# EAGLE design baxandall (EAGLE 7.7.0)

## Sheet 1 of 6
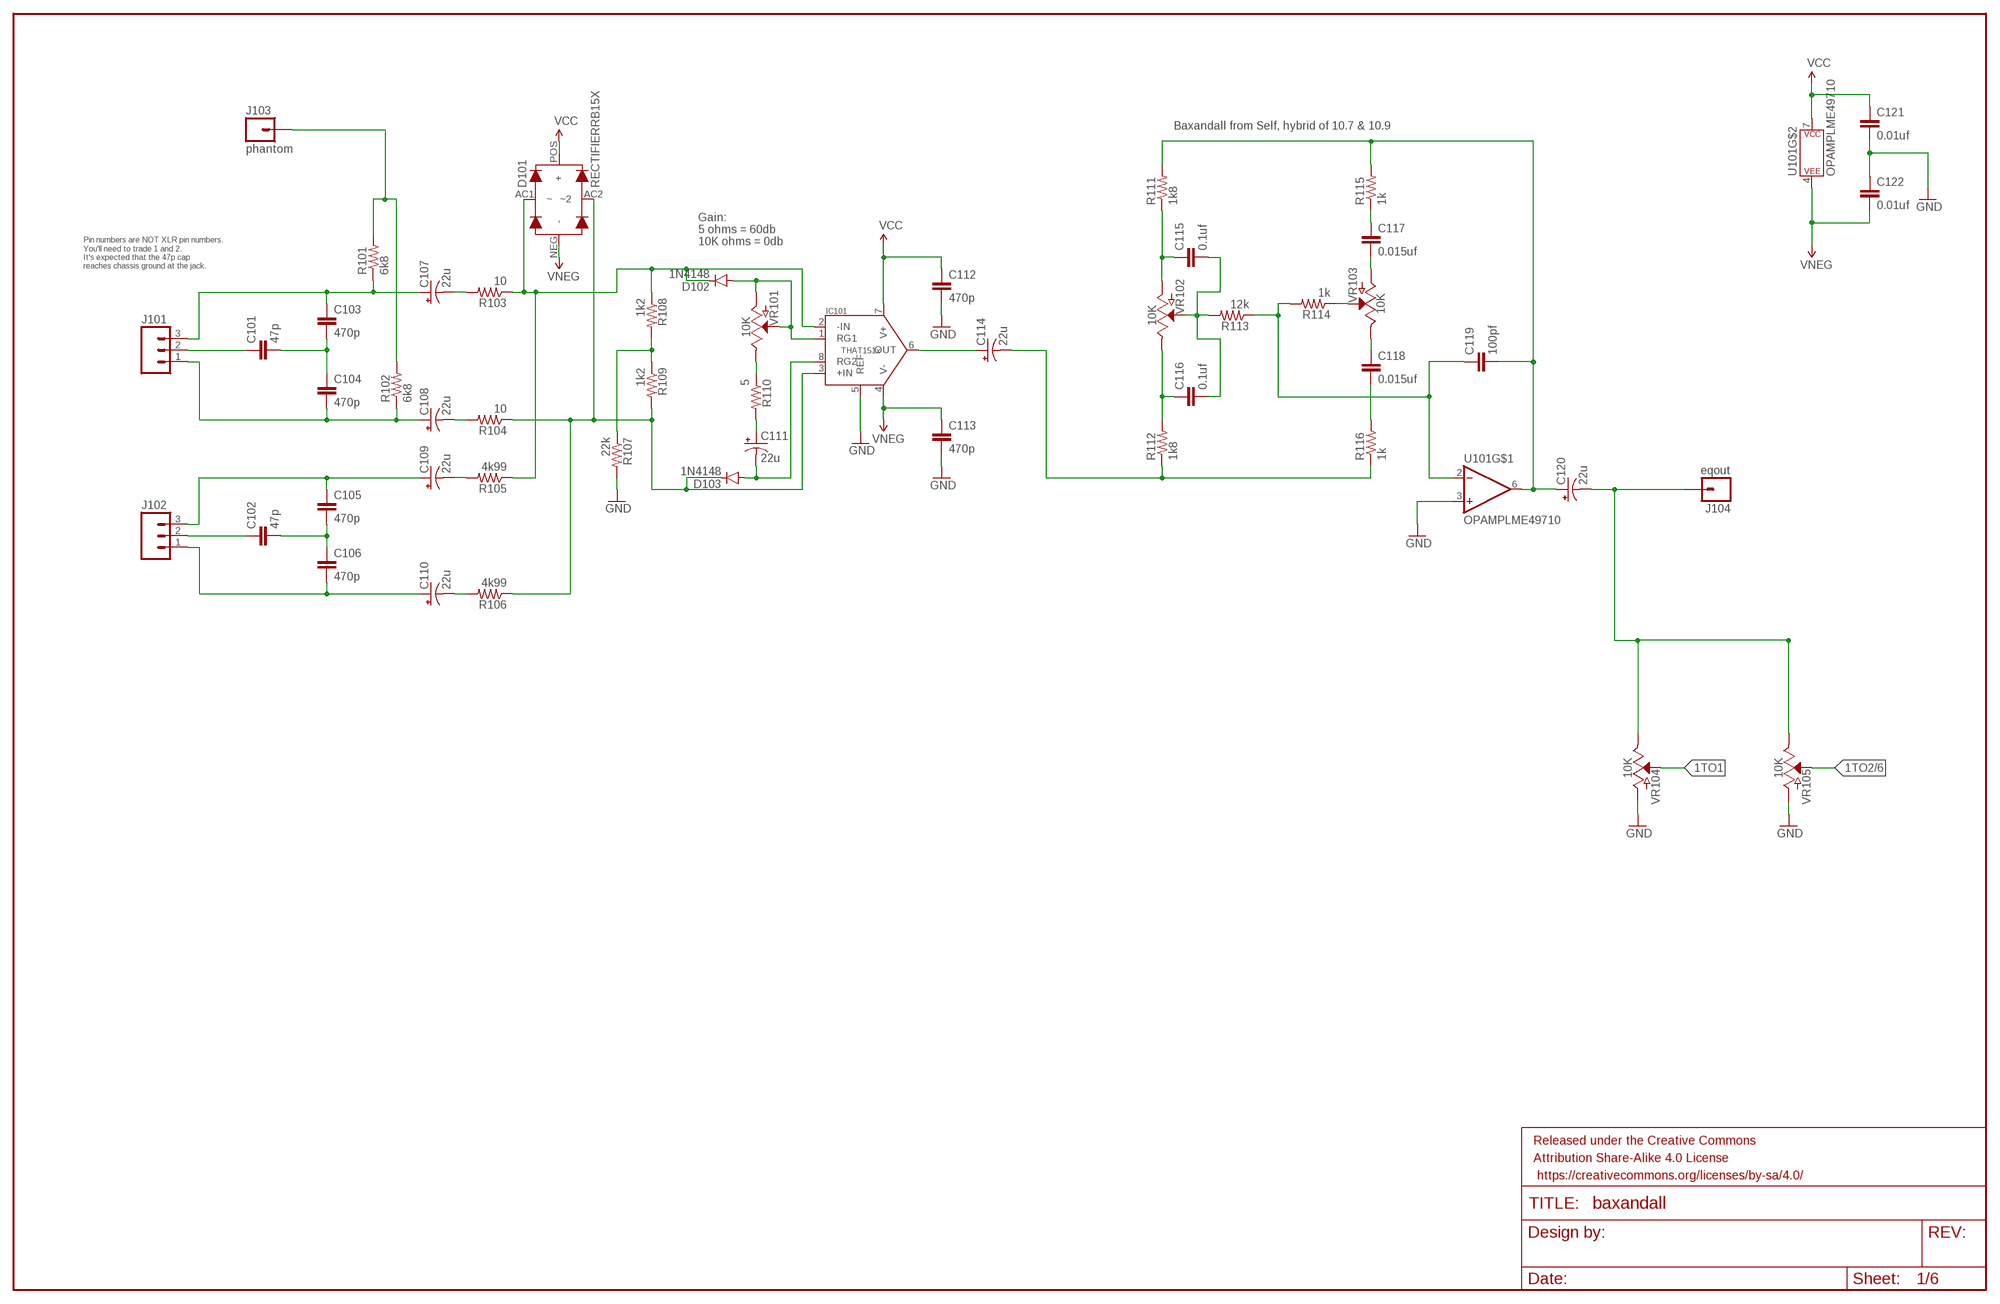
[diagram p0: schematic, sheet 1]

### Parts
C101  47p  CAPPTH  [CAP-PTH-SMALL]
C102  47p  CAPPTH  [CAP-PTH-SMALL]
C103  470p  CAPPTH  [CAP-PTH-SMALL]
C104  470p  CAPPTH  [CAP-PTH-SMALL]
C105  470p  CAPPTH  [CAP-PTH-SMALL]
C106  470p  CAPPTH  [CAP-PTH-SMALL]
C107  22u  100UF-25V-20%(PTH)  [CPOL-RADIAL-100UF-25V]
C108  22u  100UF-25V-20%(PTH)  [CPOL-RADIAL-100UF-25V]
C109  22u  100UF-25V-20%(PTH)  [CPOL-RADIAL-100UF-25V]
C110  22u  100UF-25V-20%(PTH)  [CPOL-RADIAL-100UF-25V]
C111  22u  100UF-25V-20%(PTH)  [CPOL-RADIAL-100UF-25V]
C112  470p  CAPPTH  [CAP-PTH-SMALL]
C113  470p  CAPPTH  [CAP-PTH-SMALL]
C114  22u  100UF-25V-20%(PTH)  [CPOL-RADIAL-100UF-25V]
C115  0.1uf  WIMA-MKS20.1UF  [WIMA-MKS2-2.5X7.2]
C116  0.1uf  WIMA-MKS20.1UF  [WIMA-MKS2-2.5X7.2]
C117  0.015uf  WIMA-MKS20.015UF  [WIMA-MKS2-2.5X7.2]
C118  0.015uf  WIMA-MKS20.015UF  [WIMA-MKS2-2.5X7.2]
C119  100pf  CAPPTH  [CAP-PTH-SMALL]
C120  22u  100UF-25V-20%(PTH)  [CPOL-RADIAL-100UF-25V]
C121  0.01uf  WIMA-MKS20.01UF  [WIMA-MKS2-2.5X7.2]
C122  0.01uf  WIMA-MKS20.01UF  [WIMA-MKS2-2.5X7.2]
D101  RECTIFIERRB15X  [SM-RECTIFIER]
D102  1N4148  DIODE1N4148  [DIODE-1N4148]
D103  1N4148  DIODE1N4148  [DIODE-1N4148]
FRAME101  FRAME-LEDGER  [CREATIVE_COMMONS]
IC101  THAT151x  THAT151X  [DIP08-KIT]
J101  M031X03_NO_SILK  [1X03_NO_SILK]
J102  M031X03_NO_SILK  [1X03_NO_SILK]
J103  phantom  M01NOSILK-KIT  [1X01NS-KIT]
J104  eqout  M01NOSILK-KIT  [1X01NS-KIT]
R101  6k8  10KOHM-1/4W-1%(PTH)HORIZ  [AXIAL-0.3]
R102  6k8  10KOHM-1/4W-1%(PTH)HORIZ  [AXIAL-0.3]
R103  10  10KOHM-1/4W-1%(PTH)HORIZ  [AXIAL-0.3]
R104  10  10KOHM-1/4W-1%(PTH)HORIZ  [AXIAL-0.3]
R105  4k99  10KOHM-1/4W-1%(PTH)HORIZ  [AXIAL-0.3]
R106  4k99  10KOHM-1/4W-1%(PTH)HORIZ  [AXIAL-0.3]
R107  22k  10KOHM-1/4W-1%(PTH)HORIZ  [AXIAL-0.3]
R108  1k2  10KOHM-1/4W-1%(PTH)HORIZ  [AXIAL-0.3]
R109  1k2  10KOHM-1/4W-1%(PTH)HORIZ  [AXIAL-0.3]
R110  5  10KOHM-1/4W-1%(PTH)HORIZ  [AXIAL-0.3]
R111  1k8  10KOHM-1/4W-1%(PTH)HORIZ  [AXIAL-0.3]
R112  1k8  10KOHM-1/4W-1%(PTH)HORIZ  [AXIAL-0.3]
R113  12k  10KOHM-1/4W-1%(PTH)HORIZ  [AXIAL-0.3]
R114  1k  10KOHM-1/4W-1%(PTH)HORIZ  [AXIAL-0.3]
R115  1k  10KOHM-1/4W-1%(PTH)HORIZ  [AXIAL-0.3]
R116  1k  10KOHM-1/4W-1%(PTH)HORIZ  [AXIAL-0.3]
U101  OPAMPLME49710  [DIP08-KIT]
VR101  10K  POTROT-SW-POT  [ROT-SW-POT]
VR102  10K  POT10K-VERTPIN  [ALPHA-RV24AF40-POT]
VR103  10K  POT10K-VERTPIN  [ALPHA-RV24AF40-POT]
VR104  10K  POT10K-VERTPIN  [ALPHA-RV24AF40-POT]
VR105  10K  POT10K-VERTPIN  [ALPHA-RV24AF40-POT]

### Nets
1TO1: VR104.WIP(S)
1TO2: VR105.WIP(S) ; also sheet 6
GND: C112.2 C113.2 C121.P$2 C122.P$1 IC101.5(REF) R107.P$2 U101.3(+IN) VR104.CCW(A) VR105.CCW(A) ; also sheet 6
N$1: C115.P$1 R111.P$1 VR102.CCW(A)
N$2: C116.P$1 R112.P$2 VR102.CW(E)
N$3: C119.1 R113.P$1 R114.P$2 U101.2(-IN)
N$4: C118.P$2 R116.P$2
N$5: C120.2(-) J104.1 VR104.CW(E) VR105.CW(E)
N$6: C119.2 C120.1(+) R111.P$2 R115.P$2 U101.6(OUT)
N$8: R114.P$1 VR103.WIP(S)
N$9: C114.2(-) R112.P$1 R116.P$1
N$10: C118.P$1 VR103.CW(E)
N$14: C115.P$2 C116.P$2 R113.P$2 VR102.WIP(S)
N$15: C117.P$2 VR103.CCW(A)
N$19: C117.P$1 R115.P$1
N$21: C111.2(-) D103.A IC101.8(RG2)
N$22: C114.1(+) IC101.6(OUT)
N$23: C101.1 J101.2
N$24: C101.2 C103.2 C104.1
N$25: C103.1 C107.1(+) J101.3 R101.P$1
N$26: C104.2 C108.1(+) J101.1 R102.P$1
N$27: C108.2(-) R104.P$2
N$28: J103.1 R101.P$2 R102.P$2
N$29: C107.2(-) R103.P$2
N$30: D101.AC1(~) D102.C IC101.2(-IN) R103.P$1 R105.P$1 R108.P$1
N$31: D101.AC2(~2) D103.C IC101.3(+IN) R104.P$1 R106.P$1 R109.P$2
N$32: R107.P$1 R108.P$2 R109.P$1
N$33: D102.A IC101.1(RG1) VR101.CCW(A) VR101.WIP(S)
N$34: R110.P$1 VR101.CW(E)
N$35: C111.1(+) R110.P$2
N$36: C102.1 J102.2
N$37: C102.2 C105.2 C106.1
N$38: C105.1 C109.1(+) J102.3
N$39: C106.2 C110.1(+) J102.1
N$40: C110.2(-) R106.P$2
N$42: C109.2(-) R105.P$2
VCC: C112.1 C121.P$1 D101.POS(+) IC101.7(V+) U101.7(P$V+) ; also sheet 6
VNEG: C113.1 C122.P$2 D101.NEG(-) IC101.4(V-) U101.4(P$V-) ; also sheet 6

### Notes on the sheet
- Baxandall from Self, hybrid of 10.7 & 10.9
- Gain: 
  5 ohms = 60db
  10K ohms = 0db
- Pin numbers are NOT XLR pin numbers.
  You'll need to trade 1 and 2.
  It's expected that the 47p cap
  reaches chassis ground at the jack.

## Sheet 2 of 6
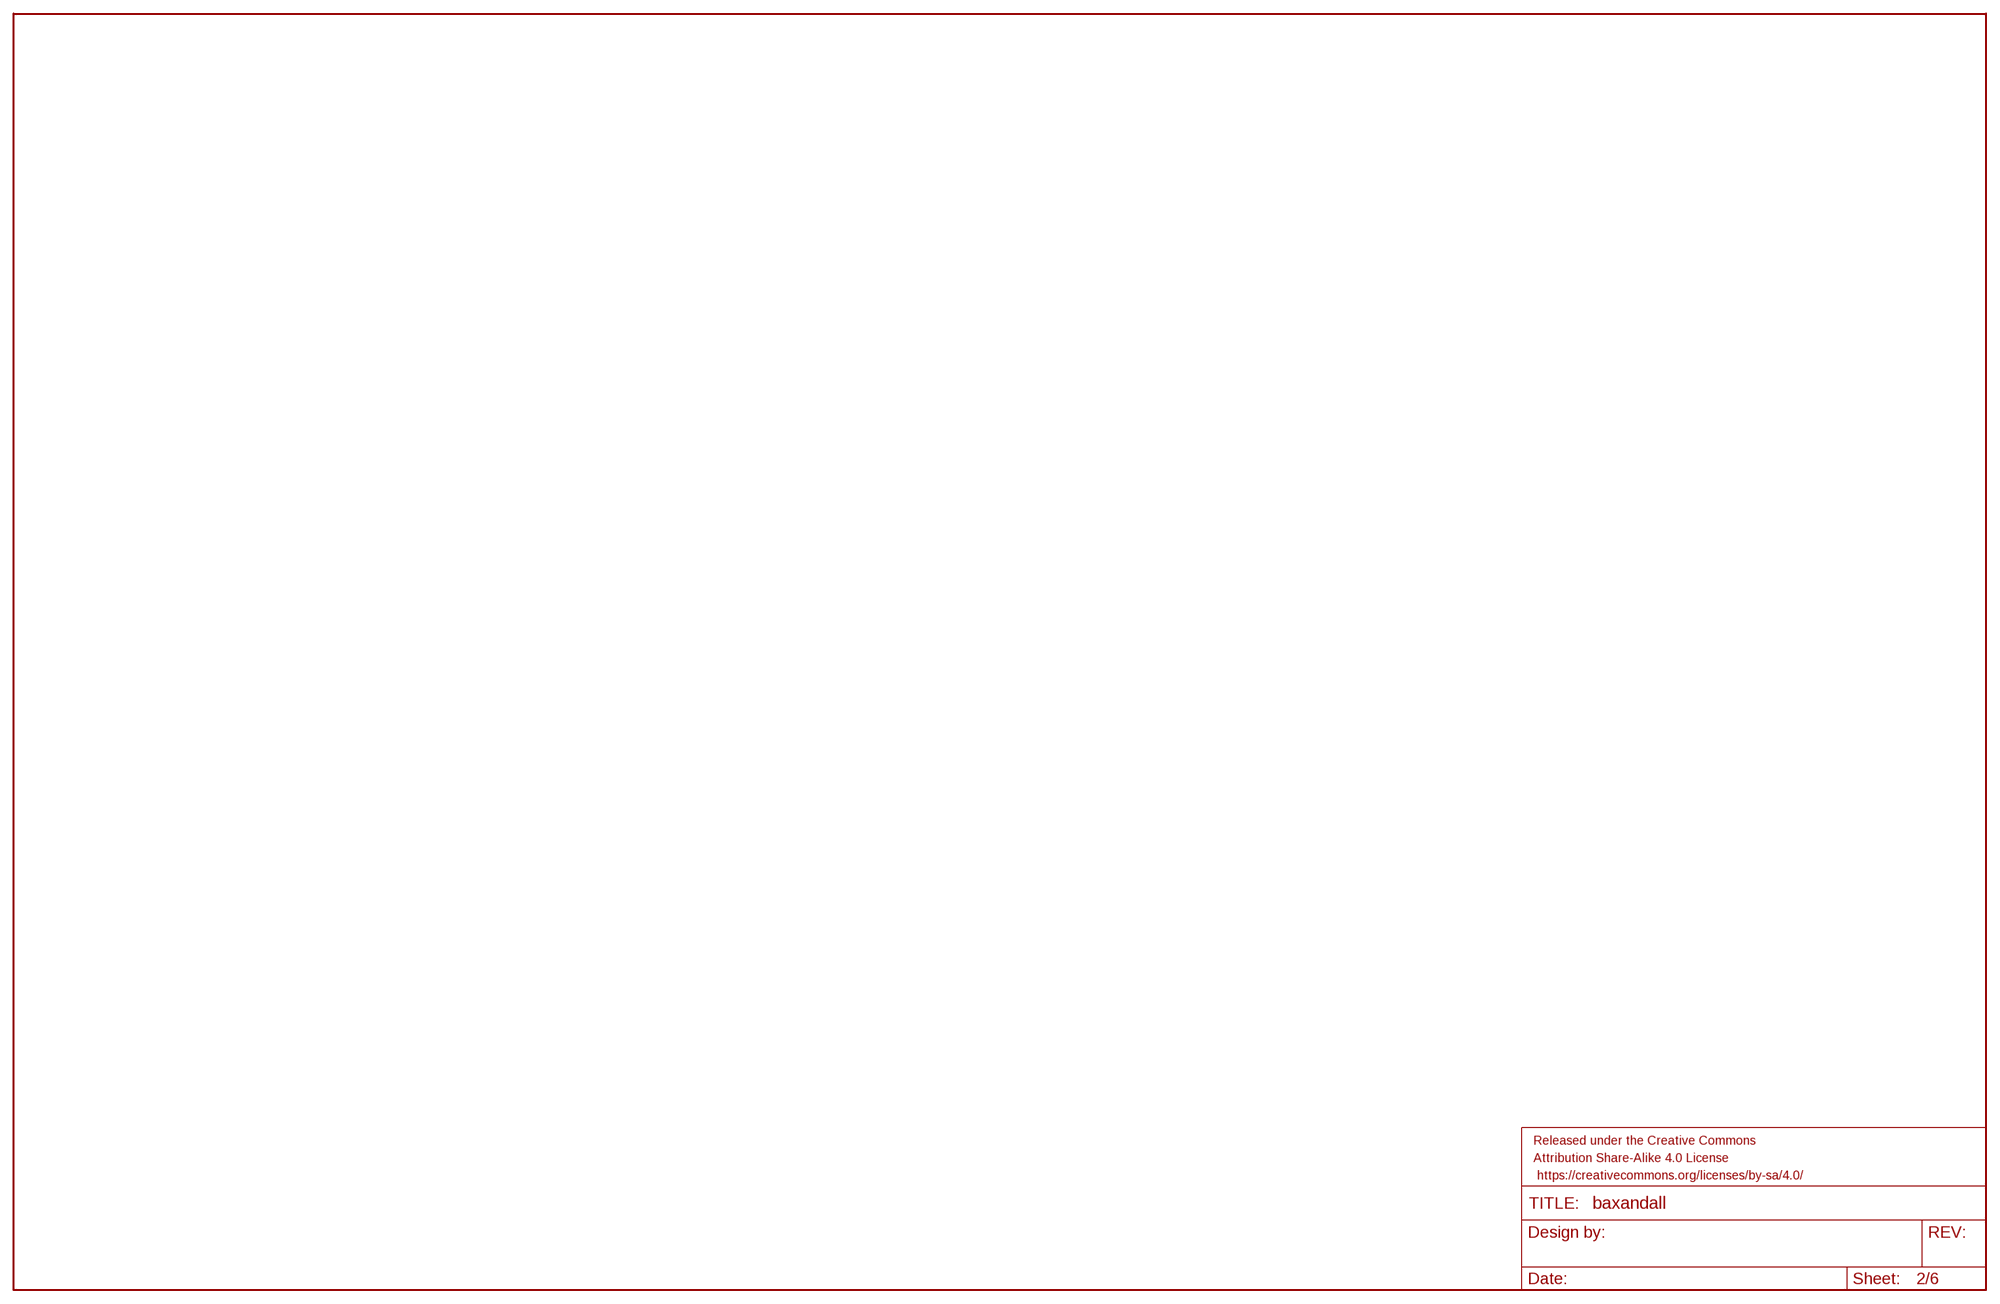
[diagram p1: schematic, sheet 2]

### Parts
FRAME201  FRAME-LEDGER  [CREATIVE_COMMONS]

## Sheet 3 of 6
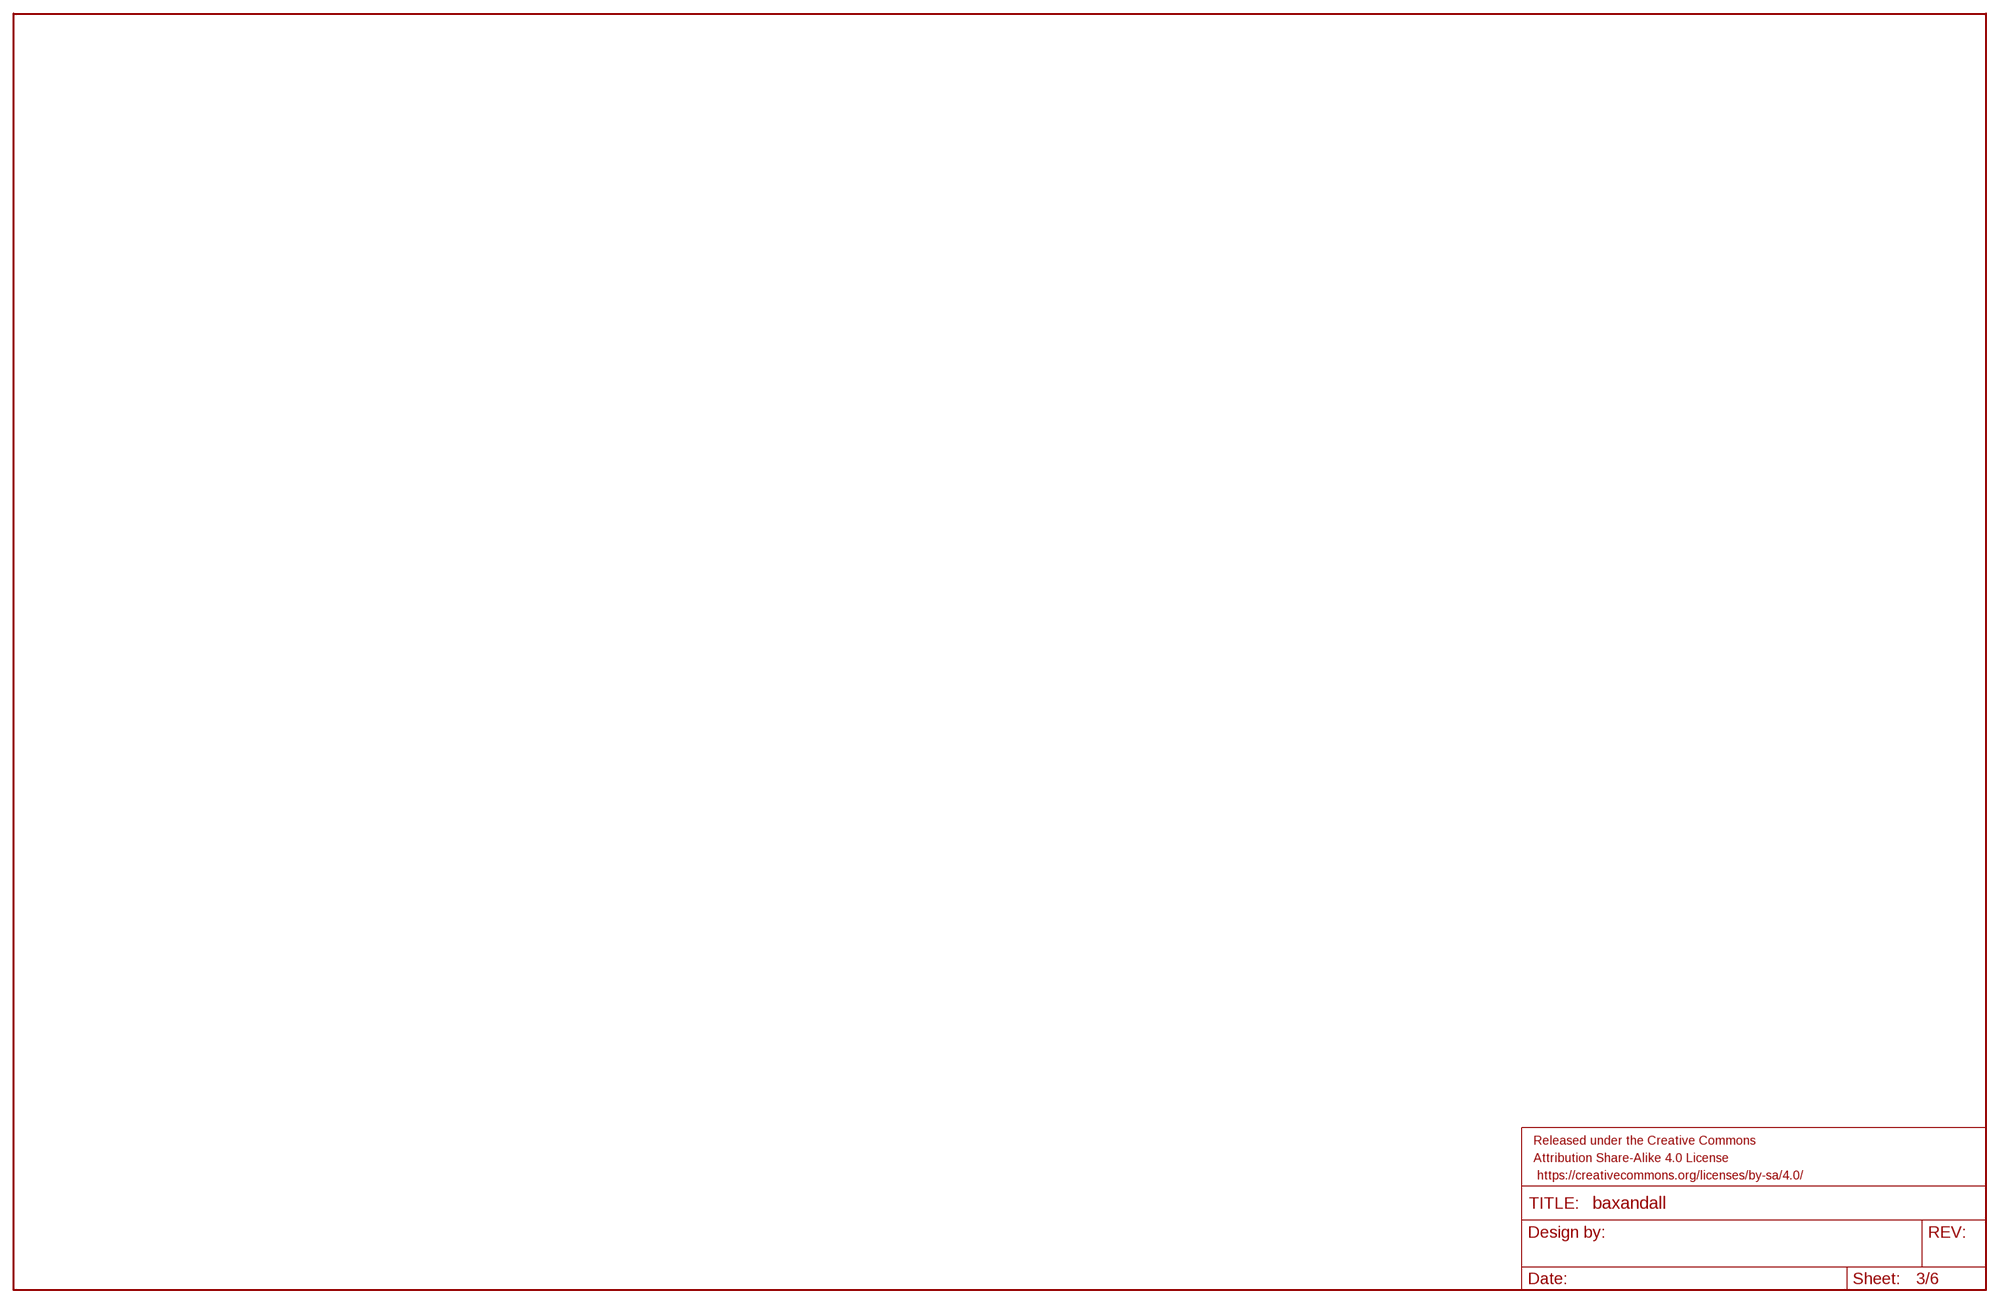
[diagram p2: schematic, sheet 3]

### Parts
FRAME301  FRAME-LEDGER  [CREATIVE_COMMONS]

## Sheet 4 of 6
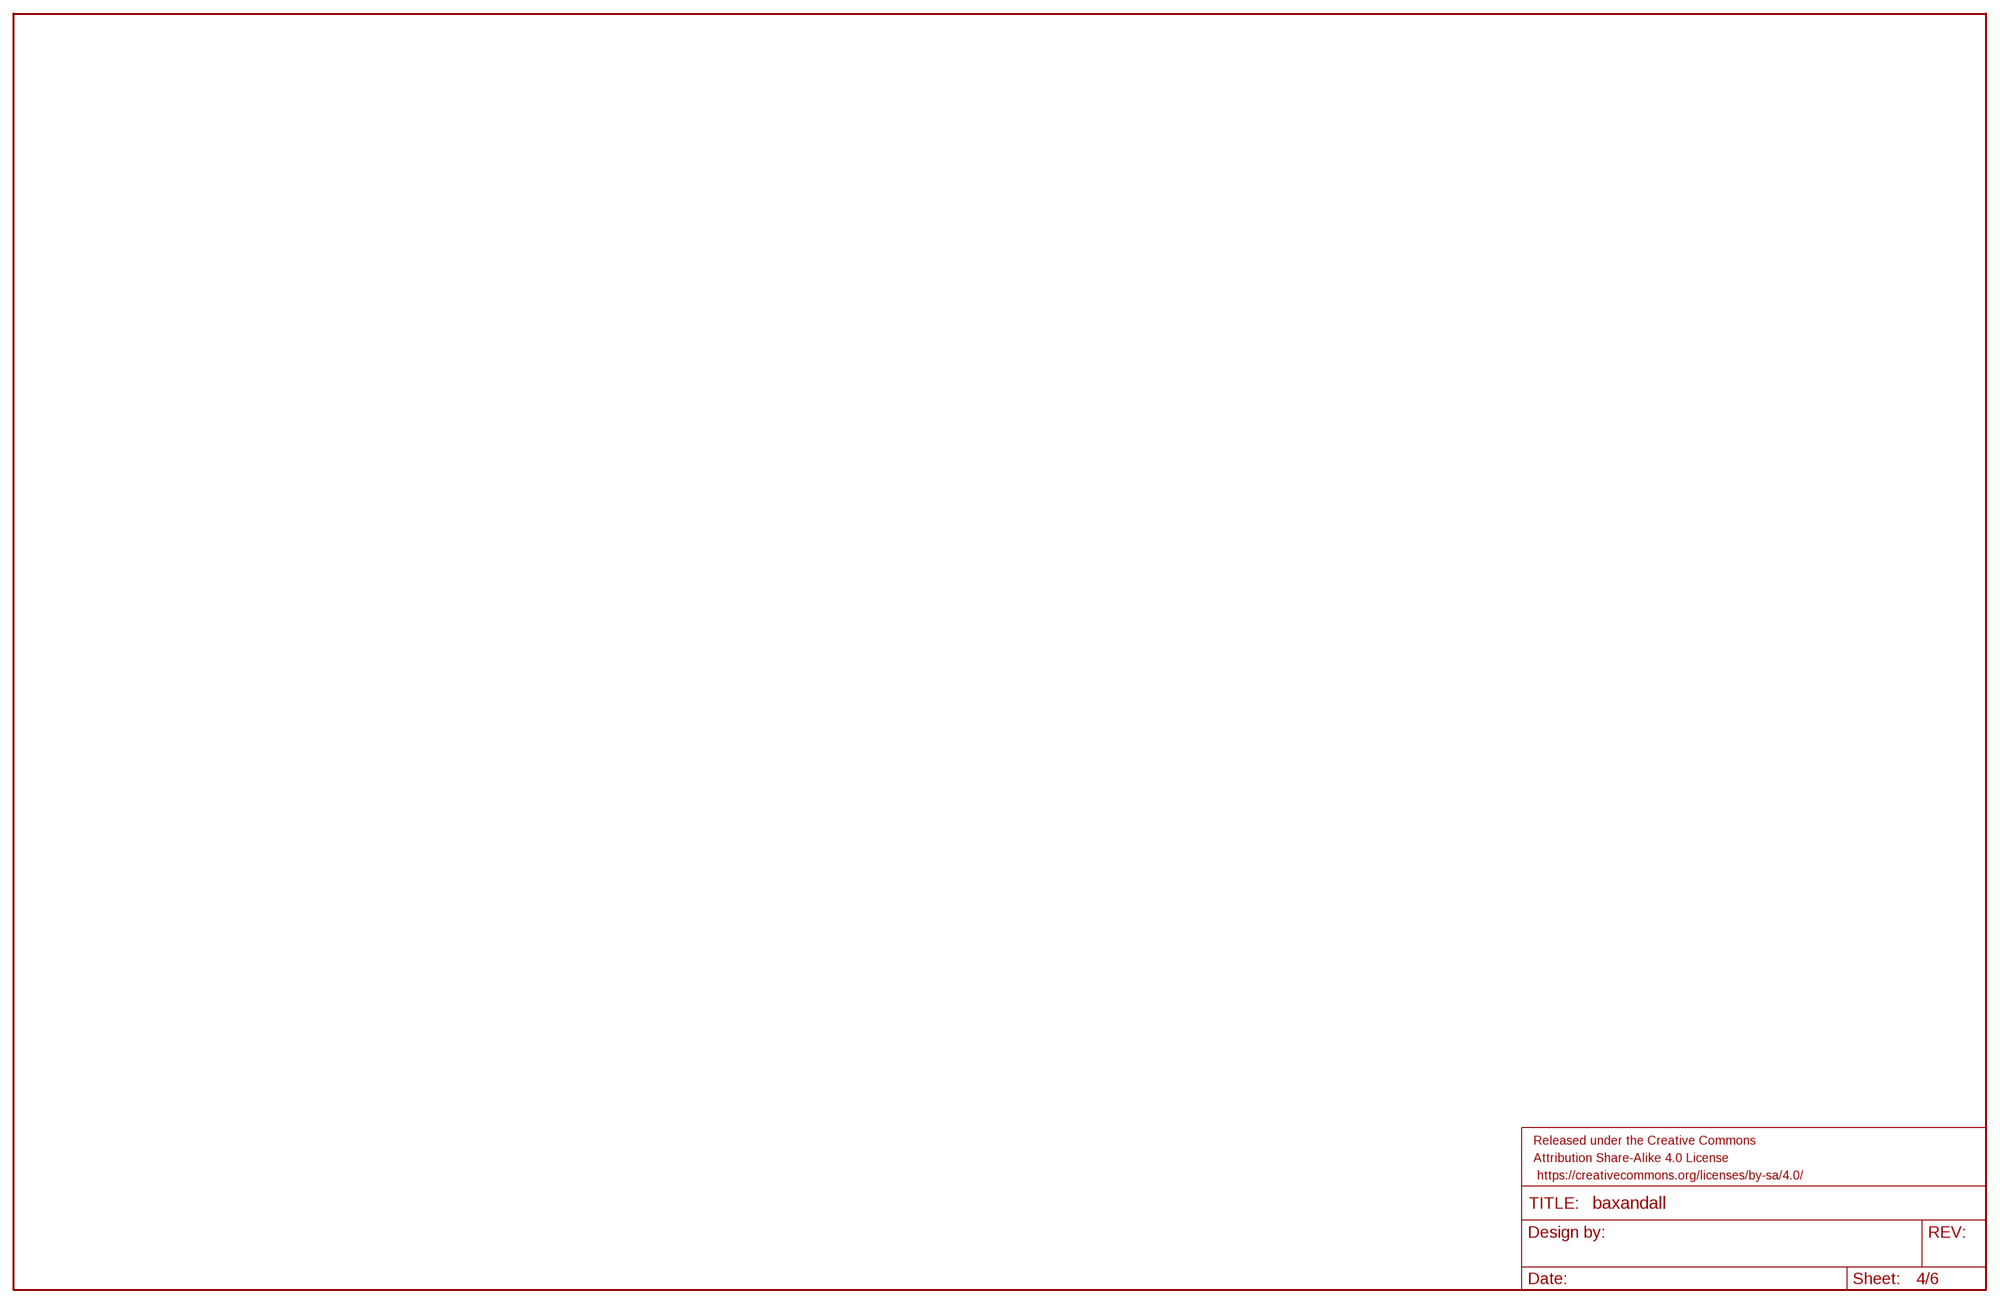
[diagram p3: schematic, sheet 4]

### Parts
FRAME401  FRAME-LEDGER  [CREATIVE_COMMONS]

## Sheet 5 of 6
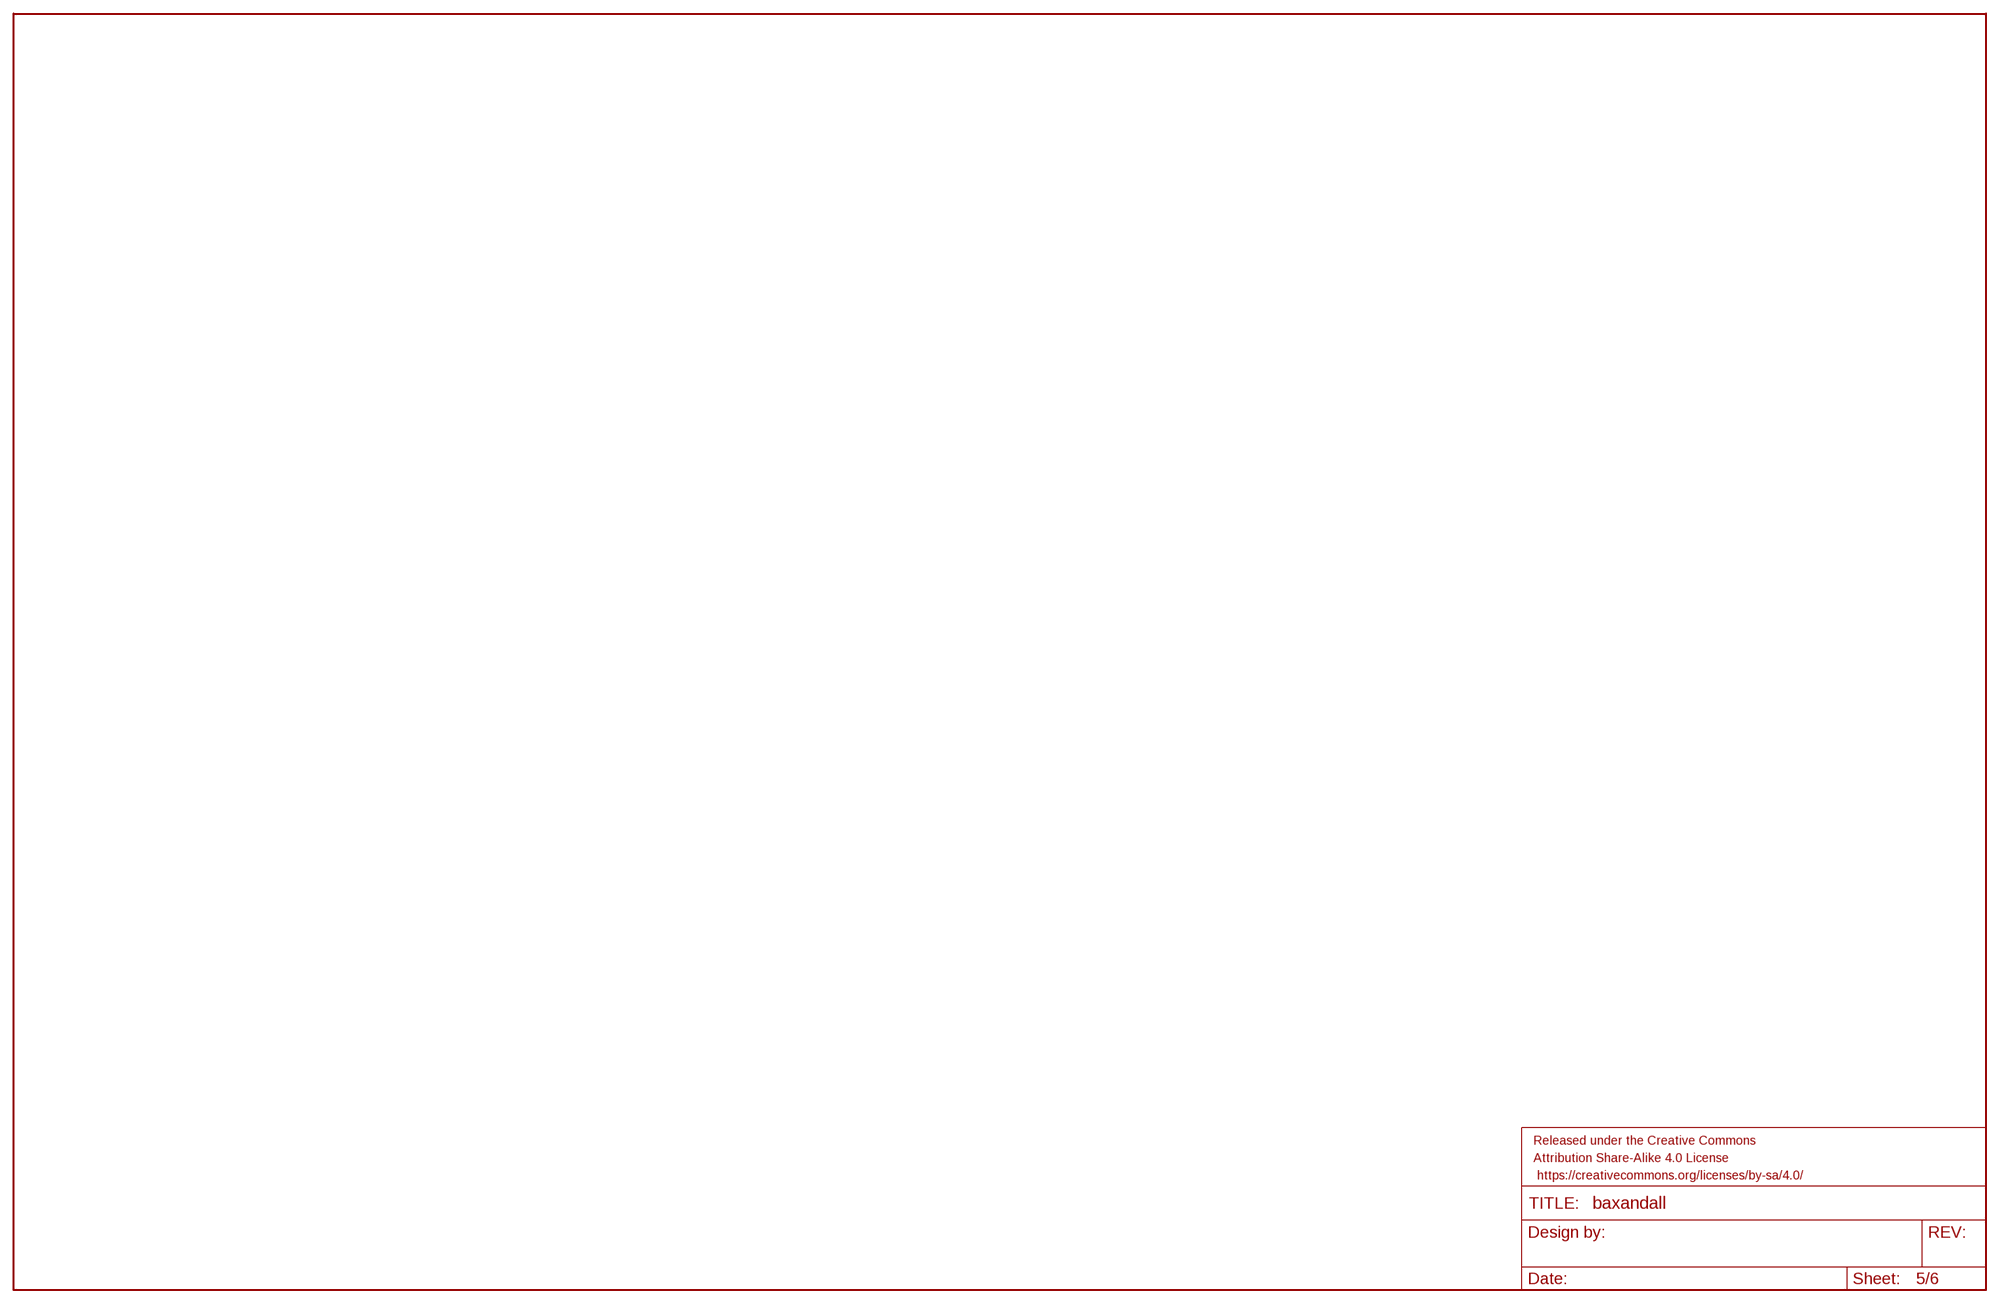
[diagram p4: schematic, sheet 5]

### Parts
FRAME501  FRAME-LEDGER  [CREATIVE_COMMONS]

## Sheet 6 of 6
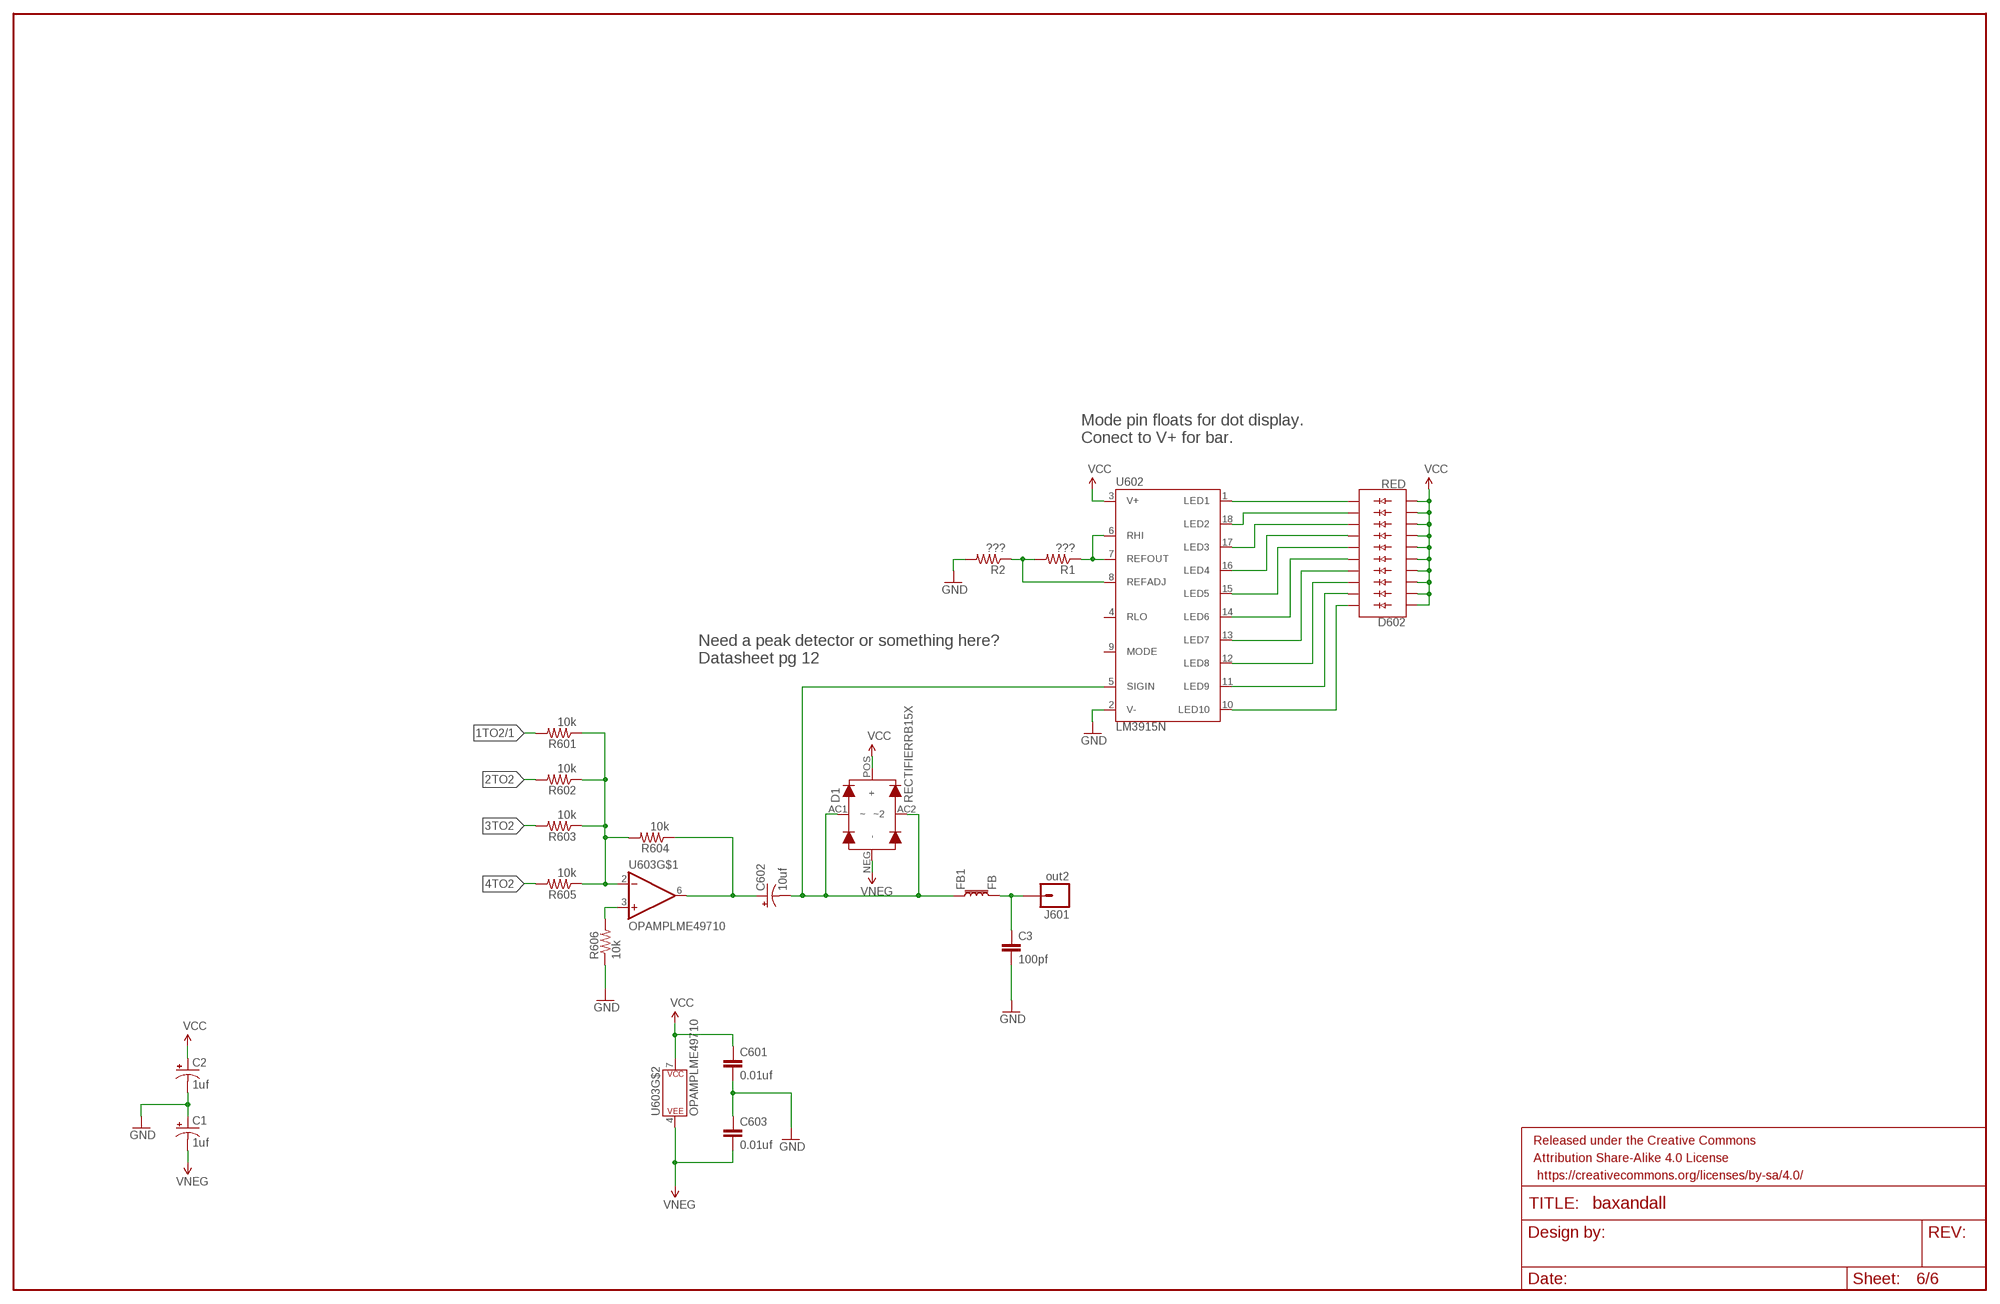
[diagram p5: schematic, sheet 6]

### Parts
C1  1uf  CAP_POLPTH2  [CPOL-RADIAL-10UF-25V]
C2  1uf  CAP_POLPTH2  [CPOL-RADIAL-10UF-25V]
C3  100pf  CAPPTH  [CAP-PTH-SMALL]
C601  0.01uf  WIMA-MKS20.01UF  [WIMA-MKS2-2.5X7.2]
C602  10uf  10UF-25V-20%(PTH)  [CPOL-RADIAL-10UF-25V]
C603  0.01uf  WIMA-MKS20.01UF  [WIMA-MKS2-2.5X7.2]
D1  RECTIFIERRB15X  [SM-RECTIFIER]
D602  RED  LED_BARGRAPH_10RED  [LED_BARGRAPH_10]
FB1  FB  [BEAD]
FRAME601  FRAME-LEDGER  [CREATIVE_COMMONS]
J601  out2  M01NOSILK-KIT  [1X01NS-KIT]
R1  ???  RESISTORAXIAL-0.3  [AXIAL-0.3]
R2  ???  RESISTORAXIAL-0.3  [AXIAL-0.3]
R601  10k  RESISTORAXIAL-0.3  [AXIAL-0.3]
R602  10k  RESISTORAXIAL-0.3  [AXIAL-0.3]
R603  10k  RESISTORAXIAL-0.3  [AXIAL-0.3]
R604  10k  RESISTORAXIAL-0.3  [AXIAL-0.3]
R605  10k  RESISTORAXIAL-0.3  [AXIAL-0.3]
R606  10k  RESISTORAXIAL-0.3  [AXIAL-0.3]
U602  LM3915N  [DIL18]
U603  OPAMPLME49710  [DIP08-KIT]

### Nets
1TO2: R601.P$2 ; also sheet 1
2TO2: R602.P$2
3TO2: R603.P$2
4TO2: R605.P$2
GND: C1.1(+) C2.2(-) C3.2 C601.P$2 C603.P$1 R2.P$2 R606.P$1 U602.2(V-) ; also sheet 1
N$7: C3.1 FB1.P$2 J601.1
N$11: C602.2(-) D1.AC1(~) D1.AC2(~2) FB1.P$1 U602.5(SIGIN)
N$13: R606.P$2 U603.3(+IN)
N$16: C602.1(+) R604.P$1 U603.6(OUT)
N$17: R601.P$1 R602.P$1 R603.P$1 R604.P$2 R605.P$1 U603.2(-IN)
N$20: D602.11(C9) U602.1(LED1)
N$41: D602.12(C8) U602.18(LED2)
N$43: D602.13(C7) U602.17(LED3)
N$44: D602.14(C6) U602.16(LED4)
N$45: D602.15(C5) U602.15(LED5)
N$46: D602.16(C4) U602.14(LED6)
N$47: D602.17(C3) U602.13(LED7)
N$48: D602.18(C2) U602.12(LED8)
N$49: D602.19(C1) U602.11(LED9)
N$50: D602.20(C) U602.10(LED10)
N$51: R1.P$1 U602.6(RHI) U602.7(REFOUT)
N$52: R1.P$2 R2.P$1 U602.8(REFADJ)
VCC: C2.1(+) C601.P$1 D1.POS(+) D602.1(A) D602.2(A1) D602.3(A2) D602.4(A3) D602.5(A4) D602.6(A5) D602.7(A6) D602.8(A7) D602.9(A8) D602.10(A9) U602.3(V+) U603.7(P$V+) ; also sheet 1
VNEG: C1.2(-) C603.P$2 D1.NEG(-) U603.4(P$V-) ; also sheet 1
Unconnected: U602.4(RLO) U602.9(MODE)

### Notes on the sheet
- Mode pin floats for dot display.
  Conect to V+ for bar.
- Need a peak detector or something here?
  Datasheet pg 12

## Library data of the parts
C1 C2 = SparkFun-Capacitors:CAP_POL: Capacitor Polarized These are standard SMD and PTH capacitors. Normally 10uF, 47uF, and 100uF in electrolytic and tantalum varieties. Always verify the external diameter of the through hole cap, it varies with capacity, voltage, and manufacturer. The EIA devices should be standard.
C3 C101-C106 C112 C113 C119 = SparkFun-Capacitors:CAP: Capacitor Standard 0603 ceramic capacitor, and 0.1" leaded capacitor.
C107-C111 C114 C120 = SparkFun-Capacitors:100UF-25V-20%(PTH): CAP-08439; PROD_ID: CAP-08439
C115 C116 = mixer:WIMA-MKS2; MOUSER: 505-MKS2.1/63/5
C117 C118 = mixer:WIMA-MKS2; MOUSER: 505-MKS20.015/63/5
C121 C122 C601 C603 = mixer:WIMA-MKS2; MOUSER: 505-MKS20.01/63/5
C602 = SparkFun-Capacitors:10UF-25V-20%(PTH): CAP-08440; PROD_ID: CAP-08440
D1 D101 = mixer:RECTIFIER; MOUSER: 583-RB153
D102 D103 = SparkFun-DiscreteSemi:DIODE: Diode These are standard reverse protection diodes and small signal diodes. SMA package can handle up to about 1A. SOD-323 can handle about 200mA. What the SOD-323 package when ordering, there are some mfgs out there that are 5-pin packages.; PROD_ID: DIO-08378
D602 = SparkFun-LED:LED_BARGRAPH_10: Young Sun LED Tech - YSLB-10251G5-10 10-Segment LED Bar Graph Features: Red Vf = 2.1V, Ifmax = 20mA Yellow Vf = 2.1V, Ifmax = 20mA Blue Vf = 3.4V, Ifmax = 20mA Green Vf = 3.4V, Ifmax = 20mA SparkFun Products: Red <https://www.sparkfun.com/products/9935> Yellow <https://www.sparkfun.com/products/9936> Green <https://www.sparkfun.com/products/9938> Blue <https://www.sparkfun.com/products/9937>; PROD_ID: DIO-10615
FB1 = mixer:FB; MOUSER: 623-2743002112LF
FRAME101 FRAME201 FRAME301 FRAME401 FRAME501 FRAME601 = SparkFun-Aesthetics:FRAME-LEDGER: Schematic Frame - Ledger Standard 11x14 US Ledger frame
IC101 = mosfet:THAT151X
J101 J102 = SparkFun-Connectors:M03: Header 3 Standard 3-pin 0.1" header. Use with straight break away headers (SKU : PRT-00116), right angle break away headers (PRT-00553), swiss pins (PRT-00743), machine pins (PRT-00117), and female headers (PRT-00115). Molex polarized connector foot print use with SKU : PRT-08232 with associated crimp pins and housings.
J103 J104 J601 = SparkFun-Connectors:M01: Header 1 Standard 1-pin 0.1" header. Use with straight break away headers (SKU : PRT-00116), right angle break away headers (PRT-00553), swiss pins (PRT-00743), machine pins (PRT-00117), and female headers (PRT-00115). SMTSO-256-ET is a "flush mount" nut for a 4-40 screw. The older package used to be too tight, and did not allow it to sit properly thru the drill hit. The latest (0.165DIA) fits nice and snug.
R1 R2 R601-R606 = SparkFun-Resistors:RESISTOR: Resistor Basic schematic elements and footprints for 0603, 1206, and PTH resistors.
R101-R116 = SparkFun-Resistors:10KOHM-1/4W-1%(PTH): RES-12183; PROD_ID: RES-12183; VALUE: 10k
U101 U603 = mixer:OPAMP; MFR: lme49710; MOUSER: 926-LME49710NA/NOPB
U602 = SparkFun-IC-Special-Function:LM391: LM3914 Dot/Bar Display Driver TTL/CMOS Logic Drives LEDs, LCDs, Vacuum Fluorecents Source: Data sheet LM3915 <http://www.national.com/ds/LM/LM3915.pdf> Data sheet LM3914 <http://www.national.com/ds/LM/LM3914.pdf> SparkFun Products: MyoWare LED Shield <https://www.sparkfun.com/products/13688> Dot/Bar Display Driver - LM3914 <https://www.sparkfun.com/products/12694>
VR101 = mixer:POT
VR102-VR105 = mixer:POT; MOUSER-PN: 31VQ401-F3

## Board
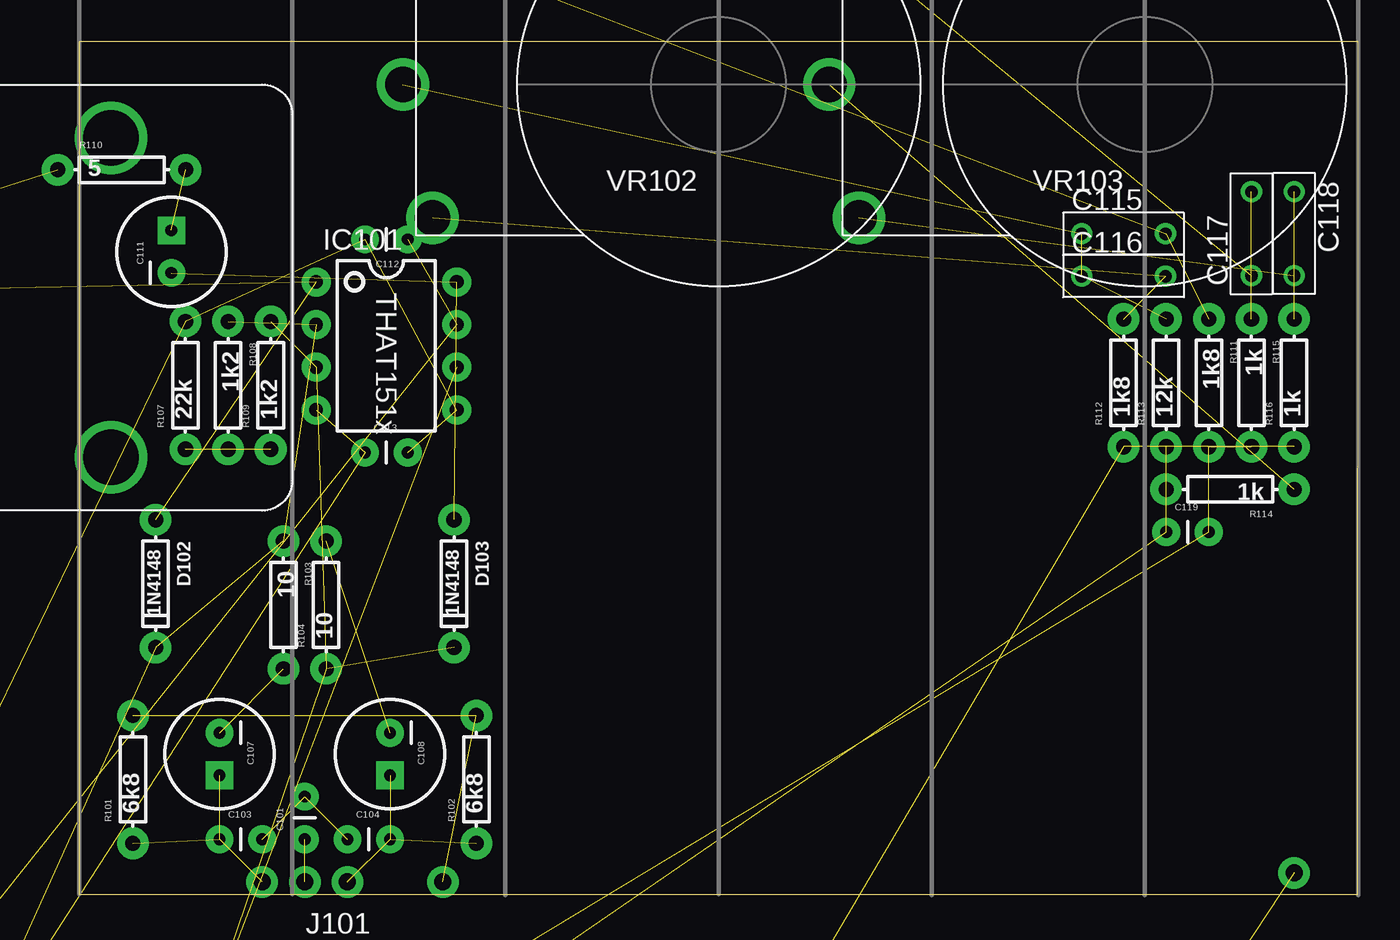
[diagram p6: board, top side]
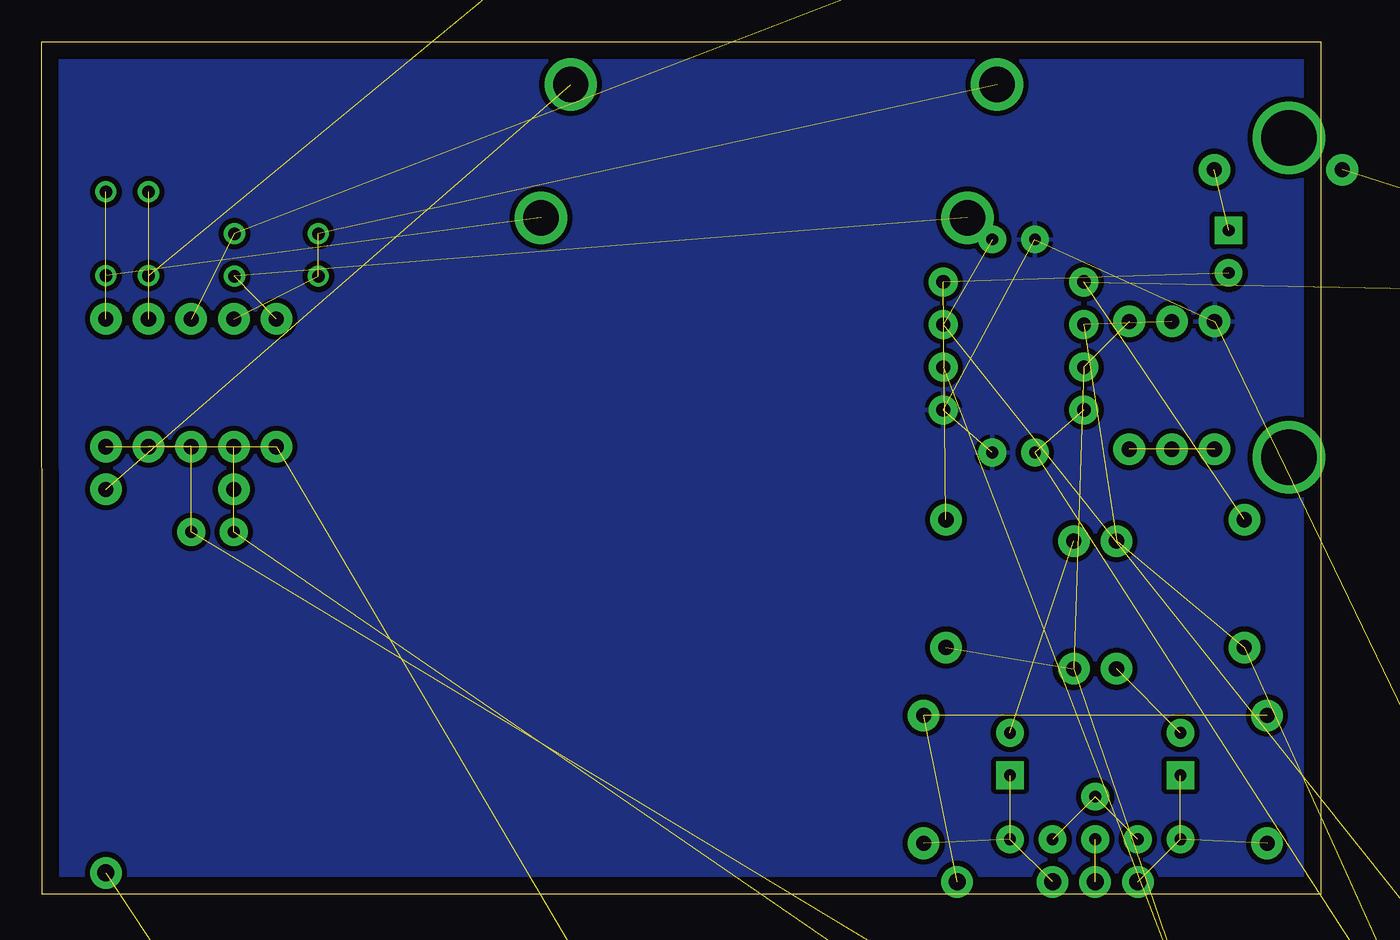
[diagram p7: board, bottom side, seen from below]

Size 76.2 x 50.8 mm. Coordinates in mm from the lower left corner, seen from the top.
Outline: 0,0 76.18,0 76.2,50.8 0,50.8 0,0
Copper layers (1*16): Top 0.035mm / dielectric 1.5mm / Bottom 0.035mm
Design rules "default": minimum track width 10mil, minimum drill 24mil, track to track 8mil, track to pad 8mil, pad to pad 8mil, via to via 8mil, smd to smd 8mil, copper to edge 40mil, drill to drill 8mil, minimum pad ring 10mil, minimum via ring 8mil, stop-mask expansion 4mil, vias tented up to drill 0mil, thermal gap 10mil

### Footprints (pad centres in the part's own frame; a part is rotated, then mirrored left to right if it is on the bottom)
CPOL-RADIAL-10UF-25V = drill 0.7 pad 1.651 square: 1 1.27,0 | drill 0.7 pad 1.651: 2 -1.27,0
CAP-PTH-SMALL = drill 0.7 pad 1.651: 1 0,0; 2 2.54,0
CPOL-RADIAL-100UF-25V = drill 0.7 pad 1.651 square: 1 1.27,0 | drill 0.7 pad 1.651: 2 -1.27,0
WIMA-MKS2-2.5X7.2 = drill 0.75: P$1 2.5,0; P$2 -2.5,0
SM-RECTIFIER = drill 1.016: AC1 -2.794,0; AC2 2.794,0; NEG 0,2.794 | drill 1.016 square: POS 0,-2.794
DIODE-1N4148 = drill 0.9 pad 1.88: A -3.81,0; C 3.81,0
LED_BARGRAPH_10 = drill 0.813 long: 1 -11.43,-3.81; 2 -8.89,-3.81; 3 -6.35,-3.81; 4 -3.81,-3.81; 5 -1.27,-3.81; 6 1.27,-3.81; 7 3.81,-3.81; 8 6.35,-3.81; 9 8.89,-3.81; 10 11.43,-3.81; 11 11.43,3.81; 12 8.89,3.81; 13 6.35,3.81; 14 3.81,3.81; 15 1.27,3.81; 16 -1.27,3.81; 17 -3.81,3.81; 18 -6.35,3.81; 19 -8.89,3.81; 20 -11.43,3.81
BEAD = drill 1.016: P$1 3,0; P$2 -3,0
DIP08-KIT = drill 0.813 pad 1.727: 1 -3.81,-4.191; 2 -1.27,-4.191; 3 1.27,-4.191; 4 3.81,-4.191; 5 3.81,4.191; 6 1.27,4.191; 7 -1.27,4.191; 8 -3.81,4.191
1X03_NO_SILK = drill 1.016 pad 1.88: 1 0,0; 2 2.54,0; 3 5.08,0
1X01NS-KIT = drill 1.016 pad 1.88: 1 0,0
AXIAL-0.3 = drill 0.9 pad 1.88: P$1 -3.81,0; P$2 3.81,0
DIL18 = drill 0.813 long: 1 -10.16,-3.81; 2 -7.62,-3.81; 3 -5.08,-3.81; 4 -2.54,-3.81; 5 0,-3.81; 6 2.54,-3.81; 7 5.08,-3.81; 8 7.62,-3.81; 9 10.16,-3.81; 10 10.16,3.81; 11 7.62,3.81; 12 5.08,3.81; 13 2.54,3.81; 14 0,3.81; 15 -2.54,3.81; 16 -5.08,3.81; 17 -7.62,3.81; 18 -10.16,3.81
ROT-SW-POT = drill 1.016: CCW 45.72,10.16; CW 45.72,15.24; WIP 45.72,12.7 | drill 3.302: P$1 10.795,3.175; P$2 10.795,22.225; P$3 42.545,22.225; P$4 42.545,3.175
ALPHA-RV24AF40-POT = drill 2.1: CCW 17.039,-7.945; CW 17.039,7.945; WIP 18.8,0

### Placement (x,y rotation side)
C1  -154.94,-585.47 0 top  (outside the outline)
C2  -154.94,-601.98 0 top  (outside the outline)
C3  -156.21,-635 0 top  (outside the outline)
C101  13.45,3.27 90 top
C102  -25.4,-170.18 0 top  (outside the outline)
C103  8.37,3.27 0 top
C104  15.99,3.27 0 top
C105  -20.32,-151.13 0 top  (outside the outline)
C106  -39.37,-151.13 0 top  (outside the outline)
C107  8.37,8.35 270 top
C108  18.53,8.35 270 top
C109  -62.23,-170.18 0 top  (outside the outline)
C110  -43.18,-170.18 0 top  (outside the outline)
C111  5.5,38.3 90 top
C112  19.58,39.03 180 top
C113  17.04,26.33 0 top
C114  -62.23,-186.69 0 top  (outside the outline)
C115  62.23,39.37 0 top
C116  62.23,36.83 0 top
C117  69.85,39.37 90 top
C118  72.39,39.37 270 top
C119  64.77,21.59 0 top
C120  -154.94,-369.57 0 top  (outside the outline)
C121  -62.23,-76.2 0 top  (outside the outline)
C122  -62.23,-63.5 0 top  (outside the outline)
C601  -156.21,-354.33 0 top  (outside the outline)
C602  -154.94,-339.09 0 top  (outside the outline)
C603  -135.89,-337.82 0 top  (outside the outline)
D1  -154.94,-654.05 0 top  (outside the outline)
D101  -60.96,-205.74 0 top  (outside the outline)
D102  4.56,18.51 270 top
D103  22.34,18.51 270 top
D602  -147.32,-529.59 0 top  (outside the outline)
FB1  -154.94,-618.49 0 top  (outside the outline)
FRAME101  -50.8,-224.79 0 top  (outside the outline)
FRAME201  -144.78,-548.64 0 top  (outside the outline)
FRAME301  -144.78,-557.53 0 top  (outside the outline)
FRAME401  -144.78,-566.42 0 top  (outside the outline)
FRAME501  -144.78,-575.31 0 top  (outside the outline)
FRAME601  -144.78,-284.48 0 top  (outside the outline)
IC101  18.31,32.68 270 top
J101  15.99,0.73 180 top
J102  -62.23,-152.4 0 top  (outside the outline)
J103  21.67,0.73 90 top
J104  72.39,1.27 0 top
J601  -129.54,-321.31 0 top  (outside the outline)
R1  -152.4,-674.37 0 top  (outside the outline)
R2  -152.4,-693.42 0 top  (outside the outline)
R101  3.21,6.84 90 top
R102  23.67,6.84 90 top
R103  12.18,17.24 270 top
R104  14.72,17.24 90 top
R105  -58.42,-133.35 0 top  (outside the outline)
R106  -31.75,-133.35 0 top  (outside the outline)
R107  6.34,30.33 90 top
R108  8.88,30.33 270 top
R109  11.42,30.33 90 top
R110  2.54,43.18 0 top
R111  67.31,30.48 270 top
R112  62.23,30.48 90 top
R113  64.77,30.48 90 top
R114  68.58,24.13 180 top
R115  69.85,30.48 270 top
R116  72.39,30.48 90 top
R601  -152.4,-387.35 0 top  (outside the outline)
R602  -152.4,-406.4 0 top  (outside the outline)
R603  -152.4,-425.45 0 top  (outside the outline)
R604  -152.4,-321.31 0 top  (outside the outline)
R605  -152.4,-444.5 0 top  (outside the outline)
R606  -125.73,-295.91 0 top  (outside the outline)
U101  -34.29,-43.18 0 top  (outside the outline)
U602  -148.59,-464.82 0 top  (outside the outline)
U603  -152.4,-298.45 0 top  (outside the outline)
VR101  12.7,48.26 180 top
VR102  38.1,48.26 180 top
VR103  63.5,48.26 180 top
VR104  -106.68,-252.73 0 top  (outside the outline)
VR105  -153.67,-252.73 0 top  (outside the outline)

### Tracks (layer width: path | path; a pad name or v marks a point on that pad's centre or on a via)
1TO2  (1 unrouted)
GND  (16 unrouted)
  pour Bottom (isolate 0.305): 0,0 0,50.8 76.2,50.8 76.2,0
N$1  (2 unrouted)
N$2  (2 unrouted)
N$3  (3 unrouted)
N$4  (1 unrouted)
N$5  (3 unrouted)
N$6  (4 unrouted)
N$7  (2 unrouted)
N$8  (1 unrouted)
N$9  (2 unrouted)
N$10  (1 unrouted)
N$11  (4 unrouted)
N$13  (1 unrouted)
N$14  (3 unrouted)
N$15  (1 unrouted)
N$16  (2 unrouted)
N$17  (5 unrouted)
N$19  (1 unrouted)
N$20  (1 unrouted)
N$21  (2 unrouted)
N$22  (1 unrouted)
N$23  (1 unrouted)
N$24  (2 unrouted)
N$25  (3 unrouted)
N$26  (3 unrouted)
N$27  (1 unrouted)
N$28  (2 unrouted)
N$29  (1 unrouted)
N$30  (5 unrouted)
N$31  (5 unrouted)
N$32  (2 unrouted)
N$33  (3 unrouted)
N$34  (1 unrouted)
N$35  (1 unrouted)
N$36  (1 unrouted)
N$37  (2 unrouted)
N$38  (2 unrouted)
N$39  (2 unrouted)
N$40  (1 unrouted)
N$41  (1 unrouted)
N$42  (1 unrouted)
N$43  (1 unrouted)
N$44  (1 unrouted)
N$45  (1 unrouted)
N$46  (1 unrouted)
N$47  (1 unrouted)
N$48  (1 unrouted)
N$49  (1 unrouted)
N$50  (1 unrouted)
N$51  (2 unrouted)
N$52  (2 unrouted)
VCC  (19 unrouted)
VNEG  (8 unrouted)